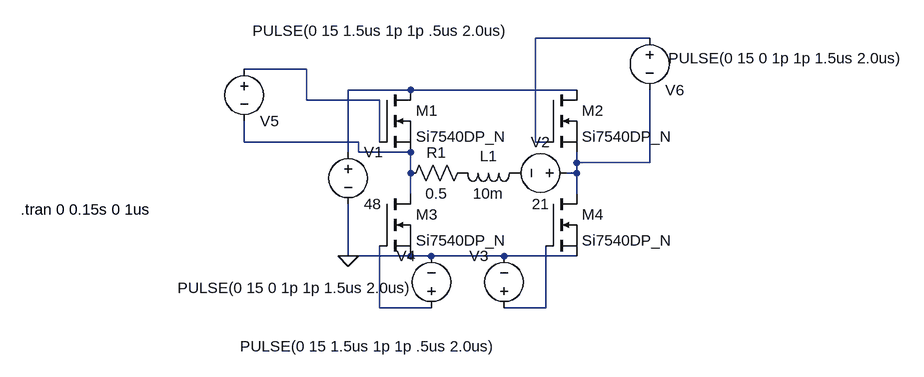
[diagram p0: schematic 2LAC VHF.asc]
2LAC VHF.asc, the LTspice schematic file:
Version 4
SHEET 1 908 680
WIRE 496 -16 320 -16
WIRE -32 32 -128 32
WIRE 128 64 32 64
WIRE 384 64 128 64
WIRE -32 80 -32 32
WIRE 80 80 -32 80
WIRE -128 144 -128 112
WIRE 48 144 -128 144
WIRE 80 144 80 80
WIRE 320 144 320 -16
WIRE 336 144 320 144
WIRE 32 160 32 64
WIRE 48 160 48 144
WIRE 128 160 48 160
WIRE 384 176 384 160
WIRE 496 176 496 64
WIRE 496 176 384 176
WIRE 128 192 128 160
WIRE 384 192 384 176
WIRE 384 192 368 192
WIRE 128 224 128 192
WIRE 384 224 384 192
WIRE 32 320 32 240
WIRE 128 320 32 320
WIRE 160 320 128 320
WIRE 272 320 160 320
WIRE 384 320 272 320
WIRE 80 400 80 304
WIRE 160 400 80 400
WIRE 336 400 336 304
WIRE 336 400 272 400
FLAG 32 320 0
SYMBOL nmos 80 64 R0
SYMATTR InstName M1
SYMATTR Value Si7540DP_N
SYMBOL nmos 336 64 R0
SYMATTR InstName M2
SYMATTR Value Si7540DP_N
SYMBOL nmos 80 224 R0
SYMATTR InstName M3
SYMATTR Value Si7540DP_N
SYMBOL nmos 336 224 R0
SYMATTR InstName M4
SYMATTR Value Si7540DP_N
SYMBOL voltage 32 144 R0
WINDOW 123 0 0 Left 0
WINDOW 39 0 0 Left 0
SYMATTR InstName V1
SYMATTR Value 48
SYMBOL res 224 176 R90
WINDOW 0 0 56 VBottom 2
WINDOW 3 32 56 VTop 2
SYMATTR InstName R1
SYMATTR Value 0.5
SYMBOL ind 304 176 R90
WINDOW 0 5 56 VBottom 2
WINDOW 3 32 56 VTop 2
SYMATTR InstName L1
SYMATTR Value 10m
SYMBOL voltage 384 192 R90
WINDOW 0 -32 56 VBottom 2
WINDOW 3 32 56 VTop 2
WINDOW 123 0 0 Left 0
WINDOW 39 0 0 Left 0
SYMATTR InstName V2
SYMATTR Value 21
SYMBOL voltage 272 416 R180
WINDOW 0 24 96 Left 2
WINDOW 3 13 -43 Left 2
WINDOW 123 0 0 Left 0
WINDOW 39 0 0 Left 0
SYMATTR InstName V3
SYMATTR Value PULSE(0 15 1.5us 1p 1p .5us 2.0us)
SYMBOL voltage 160 416 R180
WINDOW 0 24 96 Left 2
WINDOW 3 29 47 Left 2
WINDOW 123 0 0 Left 0
WINDOW 39 0 0 Left 0
SYMATTR InstName V4
SYMATTR Value PULSE(0 15 0 1p 1p 1.5us 2.0us)
SYMBOL voltage -128 16 R0
WINDOW 0 24 96 Left 2
WINDOW 3 13 -43 Left 2
WINDOW 123 0 0 Left 0
WINDOW 39 0 0 Left 0
SYMATTR InstName V5
SYMATTR Value PULSE(0 15 1.5us 1p 1p .5us 2.0us)
SYMBOL voltage 496 -32 R0
WINDOW 0 24 96 Left 2
WINDOW 3 29 47 Left 2
WINDOW 123 0 0 Left 0
WINDOW 39 0 0 Left 0
SYMATTR InstName V6
SYMATTR Value PULSE(0 15 0 1p 1p 1.5us 2.0us)
TEXT -472 248 Left 2 !.tran 0 0.15s 0 1us

The netlist it stands for:
* 2LAC VHF.asc
M1 N003 N002 N004 N004 Si7540DP_N
M2 N003 N001 N005 N005 Si7540DP_N
M3 N004 N006 0 0 Si7540DP_N
M4 N005 N007 0 0 Si7540DP_N
V1 N003 0 48
R1 P001 N004 0.5
L1 P002 P001 10m
V2 N005 P002 21
V3 N007 0 PULSE(0 15 1.5us 1p 1p .5us 2.0us)
V4 N006 0 PULSE(0 15 0 1p 1p 1.5us 2.0us)
V5 N002 N004 PULSE(0 15 1.5us 1p 1p .5us 2.0us)
V6 N001 N005 PULSE(0 15 0 1p 1p 1.5us 2.0us)
.model NMOS NMOS
.model PMOS PMOS
.lib standard.mos
.tran 0 0.15s 0 1us
.backanno
.end